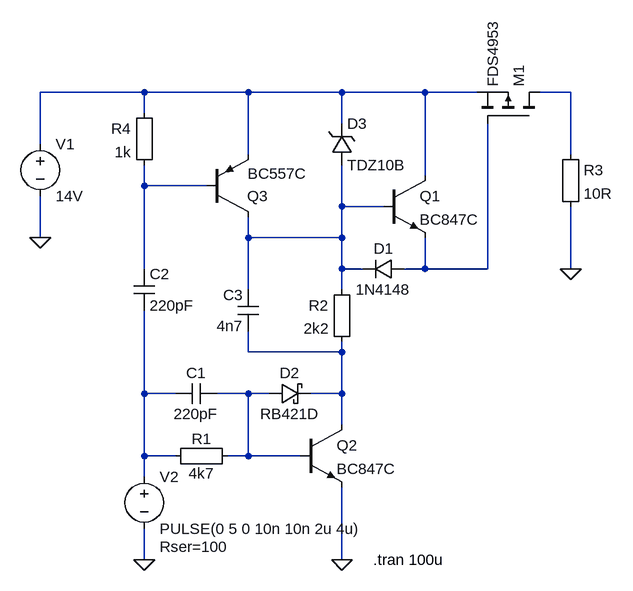
[diagram p0: schematic P-channel MOSFET shift_2.asc]
P-channel MOSFET shift_2.asc, the LTspice schematic file:
Version 4
SHEET 1 1044 680
WIRE -240 -96 -400 -96
WIRE -80 -96 -240 -96
WIRE 64 -96 -80 -96
WIRE 192 -96 64 -96
WIRE 272 -96 192 -96
WIRE 416 -96 368 -96
WIRE -240 -64 -240 -96
WIRE 64 -48 64 -96
WIRE -400 -16 -400 -96
WIRE -80 0 -80 -96
WIRE 416 0 416 -96
WIRE 192 32 192 -96
WIRE -240 48 -240 16
WIRE -144 48 -240 48
WIRE 64 80 64 16
WIRE 128 80 64 80
WIRE -400 128 -400 64
WIRE -80 128 -80 96
WIRE 64 128 64 80
WIRE 64 128 -80 128
WIRE -240 176 -240 48
WIRE 64 176 64 128
WIRE 96 176 64 176
WIRE 192 176 192 128
WIRE 192 176 160 176
WIRE 288 176 288 -48
WIRE 288 176 192 176
WIRE 416 176 416 80
WIRE -80 208 -80 128
WIRE 64 208 64 176
WIRE -80 304 -80 272
WIRE 64 304 64 288
WIRE 64 304 -80 304
WIRE -240 368 -240 240
WIRE -192 368 -240 368
WIRE -80 368 -128 368
WIRE -48 368 -80 368
WIRE 64 368 64 304
WIRE 64 368 16 368
WIRE 64 416 64 368
WIRE -240 464 -240 368
WIRE -192 464 -240 464
WIRE -80 464 -80 368
WIRE -80 464 -112 464
WIRE 0 464 -80 464
WIRE -240 496 -240 464
WIRE -240 624 -240 576
WIRE 64 624 64 512
FLAG -400 128 0
FLAG 416 176 0
FLAG -240 624 0
FLAG 64 624 0
SYMBOL npn 128 32 R0
SYMATTR InstName Q1
SYMATTR Value BC847C
SYMBOL Misc\\EuropeanResistor 80 192 M0
SYMATTR InstName R2
SYMATTR Value 2k2
SYMBOL voltage -400 -32 R0
WINDOW 123 0 0 Left 2
WINDOW 39 0 0 Left 2
SYMATTR InstName V1
SYMATTR Value 14V
SYMBOL pmos 368 -48 M270
SYMATTR InstName M1
SYMATTR Value FDS4953
SYMBOL Misc\\EuropeanResistor 400 -16 R0
SYMATTR InstName R3
SYMATTR Value 10R
SYMBOL voltage -240 480 R0
WINDOW 123 0 0 Left 2
WINDOW 39 24 124 Left 2
SYMATTR SpiceLine Rser=100
SYMATTR InstName V2
SYMATTR Value PULSE(0 5 0 10n 10n 2u 4u)
SYMBOL diode 160 160 R90
WINDOW 0 0 32 VBottom 2
WINDOW 3 32 32 VTop 2
SYMATTR InstName D1
SYMATTR Value 1N4148
SYMBOL zener 48 16 M180
WINDOW 0 24 64 Left 2
WINDOW 3 24 0 Left 2
SYMATTR InstName D3
SYMATTR Value TDZ10B
SYMATTR Description Diode
SYMATTR Type diode
SYMBOL npn 0 416 R0
SYMATTR InstName Q2
SYMATTR Value BC847C
SYMBOL Misc\\EuropeanResistor -96 448 R90
WINDOW 0 5 56 VBottom 2
WINDOW 3 27 56 VTop 2
SYMATTR InstName R1
SYMATTR Value 4k7
SYMBOL schottky -48 384 R270
WINDOW 0 32 32 VTop 2
WINDOW 3 0 32 VBottom 2
SYMATTR InstName D2
SYMATTR Value RB421D
SYMATTR Description Diode
SYMATTR Type diode
SYMBOL cap -128 352 R90
WINDOW 0 0 32 VBottom 2
WINDOW 3 32 32 VTop 2
SYMATTR InstName C1
SYMATTR Value 220pF
SYMBOL pnp -144 96 M180
WINDOW 0 62 32 Left 2
WINDOW 3 63 67 Left 2
SYMATTR InstName Q3
SYMATTR Value BC557C
SYMBOL Misc\\EuropeanResistor -224 -80 M0
SYMATTR InstName R4
SYMATTR Value 1k
SYMBOL cap -256 176 R0
SYMATTR InstName C2
SYMATTR Value 220pF
SYMBOL cap -64 208 M0
SYMATTR InstName C3
SYMATTR Value 4n7
TEXT 112 624 Left 2 !.tran 100u

The netlist it stands for:
* P-channel MOSFET shift_2.asc
Q1 N001 N004 N005 0 BC847C
R2 N004 N006 2k2
V1 N001 0 14V
M1 N002 N005 N001 N001 FDS4953
R3 N002 0 10R
V2 N007 0 PULSE(0 5 0 10n 10n 2u 4u) Rser=100
D1 N005 N004 1N4148
D3 N004 N001 TDZ10B
Q2 N006 N008 0 0 BC847C
R1 N008 N007 4k7
D2 N008 N006 RB421D
C1 N008 N007 220pF
Q3 N004 N003 N001 0 BC557C
R4 N001 N003 1k
C2 N003 N007 220pF
C3 N004 N006 4n7
.model D D
.lib standard.dio
.model NPN NPN
.model PNP PNP
.lib standard.bjt
.model NMOS NMOS
.model PMOS PMOS
.lib standard.mos
.tran 100u
.backanno
.end